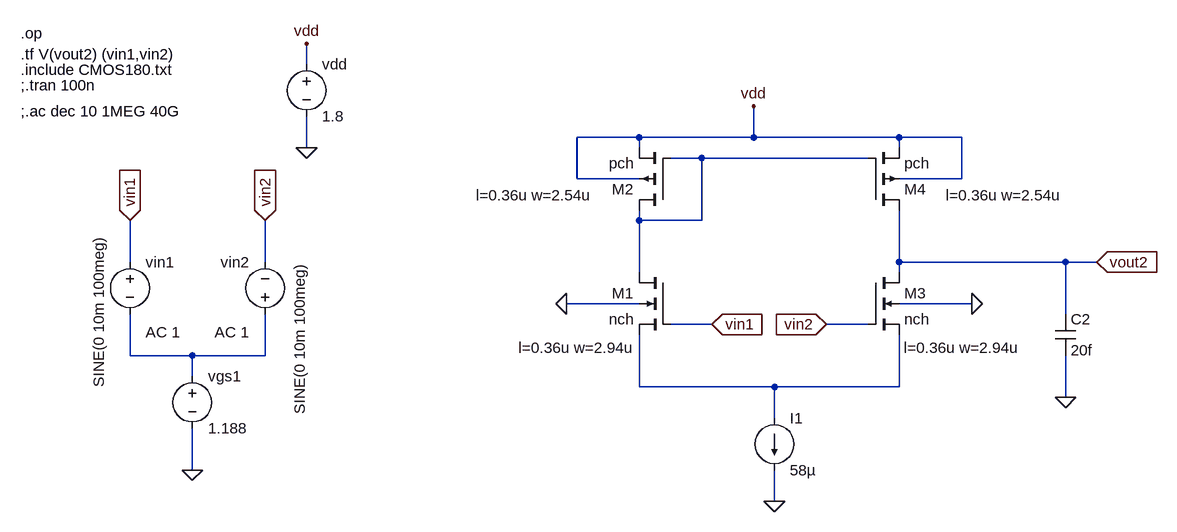
[diagram p0: schematic SINGLE STAGE OPAMP new.asc]
SINGLE STAGE OPAMP new.asc, the LTspice schematic file:
Version 4
SHEET 1 880 680
WIRE -592 -96 -592 -128
WIRE -80 16 -176 16
WIRE 96 16 96 -32
WIRE 96 16 -80 16
WIRE 320 16 96 16
WIRE 416 16 320 16
WIRE -592 32 -592 -16
WIRE -80 32 -80 16
WIRE 320 32 320 16
WIRE 16 48 -32 48
WIRE 272 48 16 48
WIRE -176 80 -176 16
WIRE -80 80 -176 80
WIRE 416 80 416 16
WIRE 416 80 320 80
WIRE -80 144 -80 128
WIRE 16 144 16 48
WIRE 16 144 -80 144
WIRE -864 208 -864 144
WIRE -656 208 -656 144
WIRE 320 208 320 128
WIRE 576 208 320 208
WIRE 624 208 576 208
WIRE -80 224 -80 144
WIRE 320 224 320 208
WIRE -80 272 -192 272
WIRE 432 272 320 272
WIRE 576 288 576 208
WIRE 32 304 -32 304
WIRE 272 304 208 304
WIRE -864 352 -864 288
WIRE -768 352 -864 352
WIRE -656 352 -656 288
WIRE -656 352 -768 352
WIRE -768 384 -768 352
WIRE -80 400 -80 320
WIRE 128 400 -80 400
WIRE 320 400 320 320
WIRE 320 400 128 400
WIRE 576 416 576 352
WIRE 128 448 128 400
WIRE -768 528 -768 464
WIRE 128 576 128 528
FLAG 96 -32 vdd
FLAG 624 208 vout2
IOPIN 624 208 In
FLAG 576 416 0
FLAG 128 576 0
FLAG -768 528 0
FLAG -864 144 vin1
IOPIN -864 144 In
FLAG -656 144 vin2
IOPIN -656 144 In
FLAG 32 304 vin1
IOPIN 32 304 In
FLAG 208 304 vin2
IOPIN 208 304 In
FLAG -592 -128 vdd
FLAG -592 32 0
FLAG -192 272 0
FLAG 432 272 0
DATAFLAG 320 160 ""
DATAFLAG 320 160 ""
DATAFLAG -80 144 ""
DATAFLAG -80 144 ""
SYMBOL nmos4 -32 224 M0
WINDOW 123 55 116 Left 2
SYMATTR Value2 l=0.36u w=2.94u
SYMATTR InstName M1
SYMATTR Value nch
SYMBOL pmos4 -32 128 R180
WINDOW 123 120 23 Left 2
SYMATTR Value2 l=0.36u w=2.54u
SYMATTR InstName M2
SYMATTR Value pch
SYMBOL nmos4 272 224 R0
WINDOW 123 55 116 Left 2
SYMATTR Value2 l=0.36u w=2.94u
SYMATTR InstName M3
SYMATTR Value nch
SYMBOL cap 560 288 R0
SYMATTR InstName C2
SYMATTR Value 20f
SYMBOL pmos4 272 128 M180
WINDOW 123 120 23 Left 2
SYMATTR Value2 l=0.36u w=2.54u
SYMATTR InstName M4
SYMATTR Value pch
SYMBOL current 128 448 R0
WINDOW 123 0 0 Left 0
WINDOW 39 0 0 Left 0
SYMATTR InstName I1
SYMATTR Value 58µ
SYMBOL voltage -768 368 R0
WINDOW 123 0 0 Left 0
WINDOW 39 0 0 Left 0
SYMATTR InstName vgs1
SYMATTR Value 1.188
SYMBOL voltage -864 192 R0
WINDOW 3 -48 -25 VRight 2
WINDOW 123 24 124 Left 2
WINDOW 39 0 0 Left 0
SYMATTR Value SINE(0 10m 100meg)
SYMATTR Value2 AC 1
SYMATTR InstName vin1
SYMBOL voltage -656 304 R180
WINDOW 0 24 96 Left 2
WINDOW 3 -53 -138 VRight 2
WINDOW 123 24 -12 Left 2
WINDOW 39 0 0 Left 0
SYMATTR InstName vin2
SYMATTR Value SINE(0 10m 100meg)
SYMATTR Value2 AC 1
SYMBOL voltage -592 -112 R0
WINDOW 123 0 0 Left 0
WINDOW 39 0 0 Left 0
SYMATTR InstName vdd
SYMATTR Value 1.8
TEXT -1032 -88 Left 2 !.include CMOS180.txt
TEXT -1032 -144 Left 2 !.op
TEXT -1032 -112 Left 2 !.tf V(vout2) (vin1,vin2)
TEXT -1032 -64 Left 2 !;.tran 100n
TEXT -1032 -24 Left 2 !;.ac dec 10 1MEG 40G

The netlist it stands for:
* SINGLE STAGE OPAMP new.asc
M1 N001 vin1 N003 0 nch l=0.36u w=2.94u
M2 N001 N001 vdd vdd pch l=0.36u w=2.54u
M3 vout2 vin2 N003 0 nch l=0.36u w=2.94u
C2 vout2 0 20f
M4 vout2 N001 vdd vdd pch l=0.36u w=2.54u
I1 N003 0 58µ
vgs1 N002 0 1.188
vin1 vin1 N002 SINE(0 10m 100meg) AC 1
vin2 N002 vin2 SINE(0 10m 100meg) AC 1
vdd vdd 0 1.8
.model NMOS NMOS
.model PMOS PMOS
.lib standard.mos
.include CMOS180.txt
.op
.tf V(vout2) (vin1,vin2)
;.tran 100n
;.ac dec 10 1MEG 40G
.backanno
.end